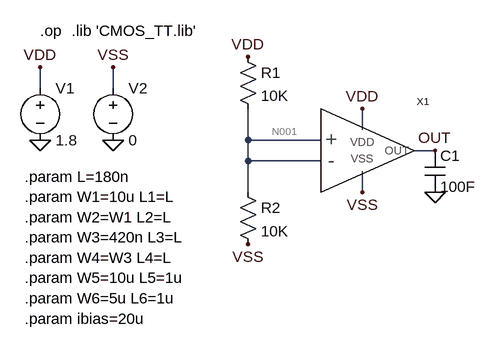
[diagram p0: schematic tb_operating_point.asc]
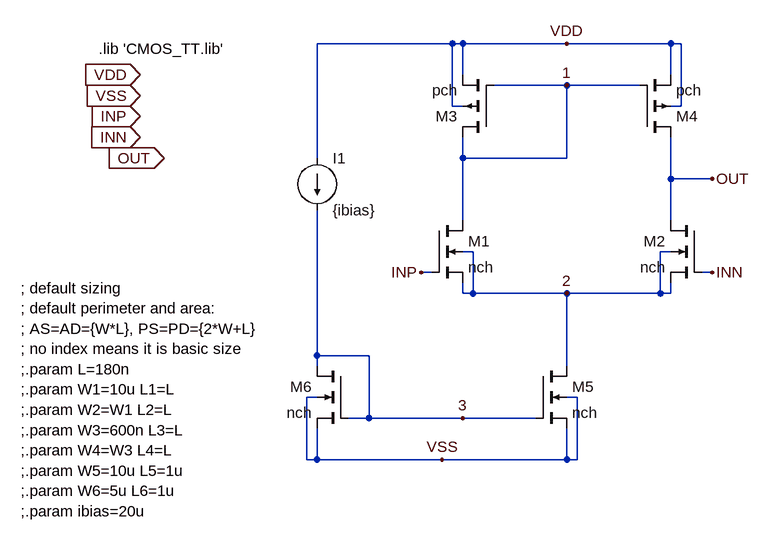
[diagram p1: sub-circuit opamp1stage_good.asc]
tb_operating_point.asc, the LTspice schematic file:
Version 4
SHEET 1 1168 680
WIRE -176 -96 -176 -128
WIRE -64 -96 -64 -128
WIRE 320 -32 320 -64
WIRE 144 -16 144 -64
WIRE 256 -16 144 -16
WIRE 432 0 400 0
WIRE 144 16 144 -16
WIRE 256 16 144 16
WIRE 144 64 144 16
WIRE 320 64 320 32
FLAG -176 -16 0
FLAG -64 -16 0
FLAG -176 -128 VDD
FLAG -64 -128 VSS
FLAG 320 -64 VDD
FLAG 144 -144 VDD
FLAG 144 144 VSS
FLAG 320 64 VSS
FLAG 432 0 OUT
FLAG 432 64 0
DATAFLAG 416 0 ""
DATAFLAG 176 -16 ""
SYMBOL voltage -176 -112 R0
WINDOW 123 0 0 Left 0
WINDOW 39 0 0 Left 0
SYMATTR InstName V1
SYMATTR Value 1.8
SYMBOL voltage -64 -112 R0
WINDOW 123 0 0 Left 0
WINDOW 39 0 0 Left 0
SYMATTR InstName V2
SYMATTR Value 0
SYMBOL opamp1stage_good 304 0 R0
SYMATTR InstName X1
SYMBOL res 128 -160 R0
SYMATTR InstName R1
SYMATTR Value 10K
SYMBOL res 128 48 R0
SYMATTR InstName R2
SYMATTR Value 10K
SYMBOL cap 416 0 R0
SYMATTR InstName C1
SYMATTR Value 100F
TEXT -176 -184 Left 2 !.op
TEXT -200 40 Left 2 !.param L=180n\n.param W1=10u L1=L\n.param W2=W1 L2=L\n.param W3=420n L3=L\n.param W4=W3 L4=L\n.param W5=10u L5=1u\n.param W6=5u L6=1u\n.param ibias=20u
TEXT -128 -184 Left 2 !.lib 'CMOS_TT.lib'

opamp1stage_good.asc, the sub-circuit schematic file:
Version 4
SHEET 1 1168 680
WIRE 512 -176 304 -176
WIRE 528 -176 512 -176
WIRE 688 -176 528 -176
WIRE 848 -176 688 -176
WIRE 864 -176 848 -176
WIRE 528 -128 528 -176
WIRE 848 -128 848 -176
WIRE 688 -112 576 -112
WIRE 800 -112 688 -112
WIRE 512 -80 512 -176
WIRE 528 -80 512 -80
WIRE 864 -80 864 -176
WIRE 864 -80 848 -80
WIRE 304 0 304 -176
WIRE 528 0 528 -32
WIRE 688 0 688 -112
WIRE 688 0 528 0
WIRE 848 32 848 -32
WIRE 912 32 848 32
WIRE 528 96 528 0
WIRE 848 96 848 32
WIRE 544 144 528 144
WIRE 848 144 832 144
WIRE 480 176 464 176
WIRE 912 176 896 176
WIRE 528 208 528 192
WIRE 544 208 544 144
WIRE 544 208 528 208
WIRE 688 208 544 208
WIRE 832 208 832 144
WIRE 832 208 688 208
WIRE 848 208 848 192
WIRE 848 208 832 208
WIRE 304 304 304 80
WIRE 384 304 304 304
WIRE 304 320 304 304
WIRE 688 320 688 208
WIRE 304 368 288 368
WIRE 704 368 688 368
WIRE 384 400 384 304
WIRE 384 400 352 400
WIRE 528 400 384 400
WIRE 640 400 528 400
WIRE 288 464 288 368
WIRE 304 464 304 416
WIRE 304 464 288 464
WIRE 496 464 304 464
WIRE 688 464 688 416
WIRE 688 464 496 464
WIRE 704 464 704 368
WIRE 704 464 688 464
FLAG 496 464 VSS
FLAG 464 176 INP
FLAG 912 176 INN
FLAG 688 -176 VDD
FLAG 688 -112 1
FLAG 688 208 2
FLAG 528 400 3
FLAG 912 32 OUT
FLAG 32 -128 VDD
IOPIN 32 -128 In
FLAG 32 -96 VSS
IOPIN 32 -96 In
FLAG 32 -64 INP
IOPIN 32 -64 In
FLAG 32 -32 INN
IOPIN 32 -32 In
FLAG -16 0 OUT
IOPIN -16 0 Out
SYMBOL nmos4 480 96 R0
SYMATTR InstName M1
SYMATTR Value nch
SYMATTR Value2 l={L1} w={W1} ad={W1*L1} as={W1*L1} pd={2*W1+L1} ps={2*W1+L1}
SYMBOL nmos4 896 96 M0
SYMATTR InstName M2
SYMATTR Value nch
SYMATTR Value2 l={L2} w={W2} ad={W2*L2} as={W2*L2} pd={2*W2+L2} ps={2*W2+L2}
SYMBOL pmos4 576 -32 R180
SYMATTR InstName M3
SYMATTR Value pch
SYMATTR Value2 l={L3} w={W3} ad={W3*L3} as={W3*L3} pd={2*W3+L3} ps={2*W3+L3}
SYMBOL pmos4 800 -32 M180
SYMATTR InstName M4
SYMATTR Value pch
SYMATTR Value2 l={L4} w={W4} ad={W4*L4} as={W4*L4} pd={2*W4+L4} ps={2*W4+L4}
SYMBOL nmos4 640 320 R0
SYMATTR InstName M5
SYMATTR Value nch
SYMATTR Value2 l={L5} w={W5} ad={W5*L5} as={W5*L5} pd={2*W5+L5} ps={2*W5+L5}
SYMBOL nmos4 352 320 M0
SYMATTR InstName M6
SYMATTR Value nch
SYMATTR Value2 l={L6} w={W6} ad={W6*L6} as={W6*L6} pd={2*W6+L6} ps={2*W6+L6}
SYMBOL current 304 0 R0
WINDOW 123 0 0 Left 0
WINDOW 39 0 0 Left 0
SYMATTR InstName I1
SYMATTR Value {ibias}
TEXT -32 -168 Left 2 !.lib 'CMOS_TT.lib'
TEXT -152 200 Left 2 !; default sizing\n; default perimeter and area:\n; AS=AD={W*L}, PS=PD={2*W+L}\n; no index means it is basic size\n;.param L=180n\n;.param W1=10u L1=L\n;.param W2=W1 L2=L\n;.param W3=600n L3=L\n;.param W4=W3 L4=L\n;.param W5=10u L5=1u\n;.param W6=5u L6=1u\n;.param ibias=20u

The netlist it stands for:
* tb_operating_point.asc
V1 VDD 0 1.8
V2 VSS 0 0
XX1 OUT N001 N001 VDD VSS opamp1stage_good
R1 VDD N001 10K
R2 N001 VSS 10K
C1 OUT 0 100F

* block symbol definitions
.subckt opamp1stage_good OUT INP INN VDD VSS
M1 1 INP 2 2 nch l={L1} w={W1} ad={W1*L1} as={W1*L1} pd={2*W1+L1} ps={2*W1+L1}
M2 OUT INN 2 2 nch l={L2} w={W2} ad={W2*L2} as={W2*L2} pd={2*W2+L2} ps={2*W2+L2}
M3 1 1 VDD VDD pch l={L3} w={W3} ad={W3*L3} as={W3*L3} pd={2*W3+L3} ps={2*W3+L3}
M4 OUT 1 VDD VDD pch l={L4} w={W4} ad={W4*L4} as={W4*L4} pd={2*W4+L4} ps={2*W4+L4}
M5 2 3 VSS VSS nch l={L5} w={W5} ad={W5*L5} as={W5*L5} pd={2*W5+L5} ps={2*W5+L5}
M6 3 3 VSS VSS nch l={L6} w={W6} ad={W6*L6} as={W6*L6} pd={2*W6+L6} ps={2*W6+L6}
I1 VDD 3 {ibias}
.lib 'CMOS_TT.lib'
; default sizing
; default perimeter and area:
; AS=AD={W*L}, PS=PD={2*W+L}
; no index means it is basic size
;.param L=180n
;.param W1=10u L1=L
;.param W2=W1 L2=L
;.param W3=600n L3=L
;.param W4=W3 L4=L
;.param W5=10u L5=1u
;.param W6=5u L6=1u
;.param ibias=20u
.ends opamp1stage_good

.model NMOS NMOS
.model PMOS PMOS
.lib standard.mos
.op
.param L=180n
.param W1=10u L1=L
.param W2=W1 L2=L
.param W3=420n L3=L
.param W4=W3 L4=L
.param W5=10u L5=1u
.param W6=5u L6=1u
.param ibias=20u
.lib 'CMOS_TT.lib'
.backanno
.end

* Results of the author's LTspice run, read from the files saved beside the schematic
* Operating Point:
*   V(vdd) = 1.8 V
*   V(vss) = 0 V
*   V(n001) = 900 mV
*   V(out) = 897.6 mV
*   I(C1) = 0 A
*   I(R2) = 90 µA
*   I(R1) = 90 µA
*   I(V2) = 149.5 µA
*   I(V1) = -149.5 µA
*   Ix(x1:OUT) = 119.7 pA
*   Ix(x1:INP) = 0 A
*   Ix(x1:INN) = 0 A
*   Ix(x1:VDD) = 59.46 µA
*   Ix(x1:VSS) = -59.46 µA
* From the log:
*   Semiconductor Device Operating Points:
*                           --- BSIM3 MOSFETS ---
*   Name:      m:x1:4      m:x1:3      m:x1:6      m:x1:5      m:x1:2
*   Model:     x1:pch      x1:pch      x1:nch      x1:nch      x1:nch
*   Id:       -1.97e-05   -1.97e-05    2.00e-05    3.95e-05    1.97e-05
*   Vgs:      -9.02e-01   -9.02e-01    6.01e-01    6.01e-01    4.87e-01
*   Vds:      -9.02e-01   -9.02e-01    6.01e-01    4.13e-01    4.85e-01
*   Vbs:       0.00e+00    0.00e+00    0.00e+00    0.00e+00    0.00e+00
*   Vth:      -4.63e-01   -4.63e-01    4.13e-01    4.14e-01    4.80e-01
*   Vdsat:    -3.50e-01   -3.50e-01    1.48e-01    1.47e-01    5.59e-02
*   Gm:        7.59e-05    7.59e-05    2.08e-04    4.12e-04    4.19e-04
*   Gds:       3.05e-06    3.05e-06    1.78e-06    4.24e-06    1.31e-05
*   Gmb        2.40e-05    2.40e-05    5.83e-05    1.16e-04    1.03e-04
*   Cbd:       3.08e-16    3.08e-16    6.89e-15    1.41e-14    7.04e-15
*   Cbs:       4.00e-16    4.00e-16    8.06e-15    1.59e-14    7.72e-15
*   Cgsov:     2.72e-16    2.72e-16    4.43e-15    8.89e-15    8.89e-15
*   Cgdov:     2.72e-16    2.72e-16    4.43e-15    8.89e-15    8.89e-15
*   Cgbov:     0.00e+00    0.00e+00    0.00e+00    0.00e+00    0.00e+00
*   dQgdVgb:   9.07e-16    9.07e-16    4.24e-14    8.52e-14    2.49e-14
*   dQgdVdb:  -2.71e-16   -2.71e-16   -4.30e-15   -8.70e-15   -8.86e-15
*   dQgdVsb:  -6.19e-16   -6.19e-16   -3.61e-14   -7.24e-14   -1.42e-14
*   dQddVgb:  -4.12e-16   -4.12e-16   -1.78e-14   -3.59e-14   -1.11e-14
*   dQddVdb:   5.79e-16    5.79e-16    1.13e-14    2.29e-14    1.59e-14
*   dQddVsb:   1.83e-16    1.83e-16    1.77e-14    3.56e-14    2.84e-15
*   dQbdVgb:  -8.36e-17   -8.36e-17   -6.76e-15   -1.34e-14   -2.66e-15
*   dQbdVdb:  -3.08e-16   -3.08e-16   -6.88e-15   -1.41e-14   -7.03e-15
*   dQbdVsb:  -4.19e-16   -4.19e-16   -1.18e-14   -2.35e-14   -8.13e-15
*   Name:      m:x1:1
*   Model:     x1:nch
*   Id:        1.97e-05
*   Vgs:       4.87e-01
*   Vds:       4.85e-01
*   Vbs:       0.00e+00
*   Vth:       4.80e-01
*   Vdsat:     5.59e-02
*   Gm:        4.19e-04
*   Gds:       1.31e-05
*   Gmb        1.03e-04
*   Cbd:       7.04e-15
*   Cbs:       7.72e-15
*   Cgsov:     8.89e-15
*   Cgdov:     8.89e-15
*   Cgbov:     0.00e+00
*   dQgdVgb:   2.49e-14
*   dQgdVdb:  -8.86e-15
*   dQgdVsb:  -1.42e-14
*   dQddVgb:  -1.11e-14
*   dQddVdb:   1.59e-14
*   dQddVsb:   2.84e-15
*   dQbdVgb:  -2.66e-15
*   dQbdVdb:  -7.03e-15
*   dQbdVsb:  -8.13e-15